# EAGLE design power (EAGLE 8.0.1)
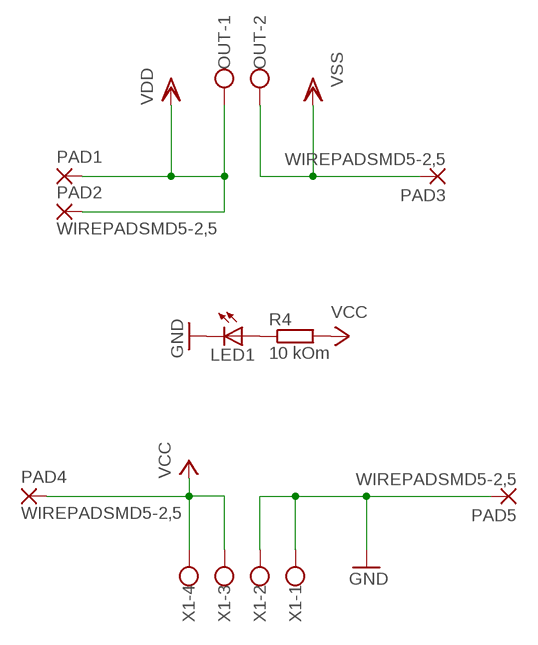
[diagram p0: schematic, sheet 1]

## Parts
LED1  LED3MM  [LED3MM]
OUT  W237-102  [W237-102]
PAD1  2,54/1,0  [2,54/1,0]
PAD2  WIREPADSMD5-2,5  [5-2,5]
PAD3  WIREPADSMD5-2,5  [5-2,5]
PAD4  WIREPADSMD5-2,5  [5-2,5]
PAD5  WIREPADSMD5-2,5  [5-2,5]
R4  10 kOm  R-EU_0207/7  [0207/7]
X1  W237-4  [W237-4]

## Nets
GND: LED1.K(C) PAD5.1(P) X1.1 X1.2
N$1: LED1.A R4.1
VCC: PAD4.1(P) R4.2 X1.3 X1.4
VDD: OUT.1 PAD1.1(P) PAD2.1(P)
VSS: OUT.2 PAD3.1(P)

## Library data of the parts
LED1 = led:LED: LED OSRAM: - CHIPLED LG R971, LG N971, LY N971, LG Q971, LY Q971, LO R971, LY R971 LH N974, LH R974 LS Q976, LO Q976, LY Q976 LO Q996 - Hyper CHIPLED LW Q18S LB Q993, LB Q99A, LB R99A - SideLED LS A670, LO A670, LY A670, LG A670, LP A670 LB A673, LV A673, LT A673, LW A673 LH A674 LY A675 LS A676, LA A676, LO A676, LY A676, LW A676 LS A679, LY A679, LG A679 - Hyper Micro SIDELED® LS Y876, LA Y876, LO Y876, LY Y876 LT Y87S - SmartLED LW L88C, LW L88S LB L89C, LB L89S, LG L890 LS L89K, LO L89K, LY L89K LS L896, LA L896, LO L896, LY L896 - TOPLED LS T670, LO T670, LY T670, LG T670, LP T670 LSG T670, LSP T670, LSY T670, LOP T670, LYG T670 LG T671, LOG T671, LSG T671 LB T673, LV T673, LT T673, LW T673 LH T674 LS T676, LA T676, LO T676, LY T676, LB T676, LH T676, LSB T676, LW T676 LB T67C, LV T67C, LT T67C, LS T67K, LO T67K, LY T67K, LW E67C LS E67B, LA E67B, LO E67B, LY E67B, LB E67C, LV E67C, LT E67C LW T67C LS T679, LY T679, LG T679 LS T770, LO T770, LY T770, LG T770, LP T770 LB T773, LV T773, LT T773, LW T773 LH T774 LS E675, LA E675, LY E675, LS T675 LS T776, LA T776, LO T776, LY T776, LB T776 LHGB T686 LT T68C, LB T68C - Hyper Mini TOPLED® LB M676 - Mini TOPLED Santana® LG M470 LS M47K, LO M47K, LY M47K Source: http://www.osram.convergy.de LUXEON: - LUMILED® LXK2-PW12-R00, LXK2-PW12-S00, LXK2-PW14-U00, LXK2-PW14-V00 LXK2-PM12-R00, LXK2-PM12-S00, LXK2-PM14-U00 LXK2-PE12-Q00, LXK2-PE12-R00, LXK2-PE12-S00, LXK2-PE14-T00, LXK2-PE14-U00 LXK2-PB12-K00, LXK2-PB12-L00, LXK2-PB12-M00, LXK2-PB14-N00, LXK2-PB14-P00, LXK2-PB14-Q00 LXK2-PR12-L00, LXK2-PR12-M00, LXK2-PR14-Q00, LXK2-PR14-R00 LXK2-PD12-Q00, LXK2-PD12-R00, LXK2-PD12-S00 LXK2-PH12-R00, LXK2-PH12-S00 LXK2-PL12-P00, LXK2-PL12-Q00, LXK2-PL12-R00 Source: www.luxeon.com KINGBRIGHT: KA-3528ASYC Source: www.kingbright.com
OUT = con-wago-500:W237-102: WAGO SCREW CLAMP; MPN: 237-102; OC_FARNELL: unknown; OC_NEWARK: 70K9898
PAD1 = wirepad:2,54/1,0: THROUGH-HOLE PAD
PAD2-PAD5 = wirepad:WIREPAD: Wire PAD connect wire on PCB
R4 = resistor:R-EU_: RESISTOR, European symbol
X1 = con-wago-500:W237-4: WAGO SCREW CLAMP; OC_FARNELL: unknown; OC_NEWARK: unknown

## Board
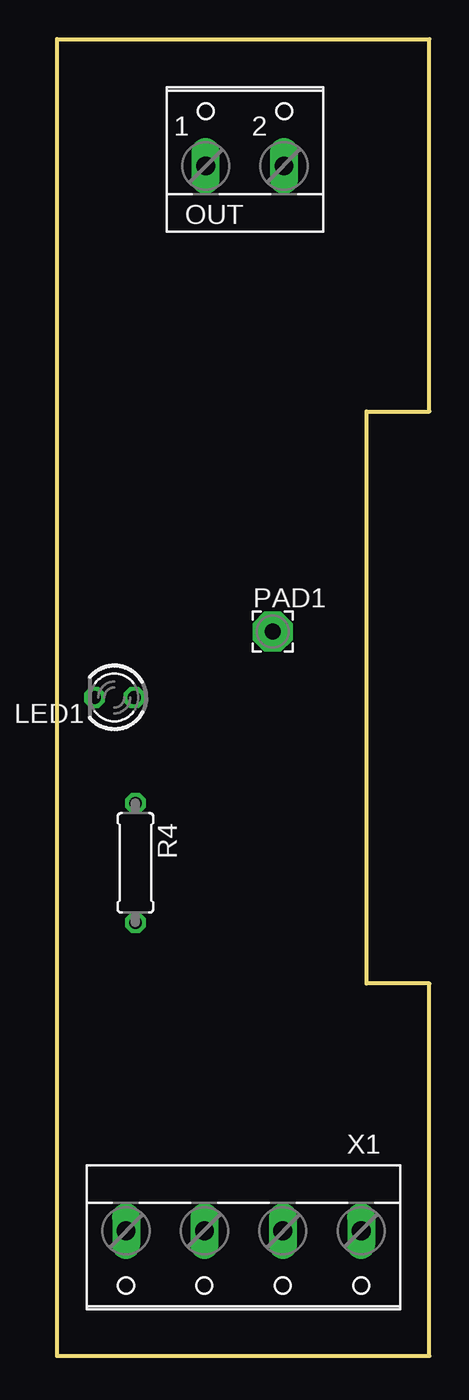
[diagram p1: board, top side]
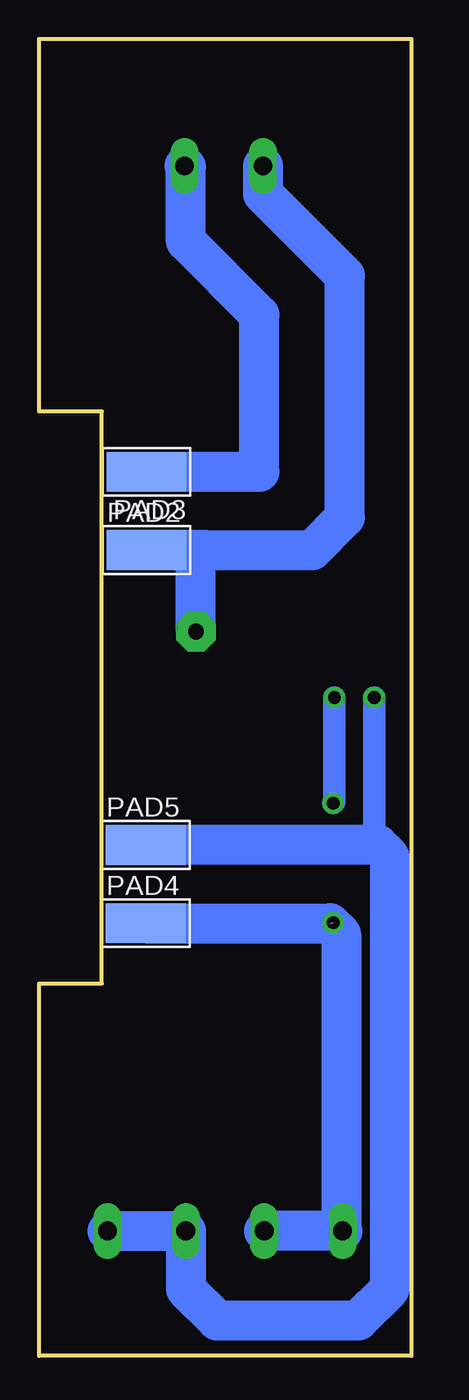
[diagram p2: board, bottom side, seen from below]

Size 23.75 x 84 mm. Coordinates in mm from the lower left corner, seen from the top.
Outline: 0,84 23.75,84 23.75,60.25 19.75,60.25 19.75,23.75 23.75,23.75 23.75,0 0,0 0,84
Copper layers (1*16): Top 0.035mm / dielectric 1.5mm / Bottom 0.035mm
Design rules "default": minimum track width 10mil, minimum drill 24mil, track to track 8mil, track to pad 8mil, pad to pad 8mil, via to via 8mil, smd to smd 8mil, copper to edge 40mil, drill to drill 8mil, minimum pad ring 10mil, minimum via ring 8mil, stop-mask expansion 4mil, vias tented up to drill 0mil, thermal gap 10mil

### Footprints (pad centres in the part's own frame; a part is rotated, then mirrored left to right if it is on the bottom)
LED3MM = drill 0.813 octagon: A -1.27,0; K 1.27,0
W237-102 = drill 1.194 long: 1 -2.5,-1.27; 2 2.5,-1.27
2,54/1,0 = drill 1.016 pad 2.54 octagon: 1 0,0
5-2,5 = smd 2.54 x 5.08: 1 0,0
0207/7 = drill 0.813 octagon: 1 -3.81,0; 2 3.81,0
W237-4 = drill 1.194 long: 1 -7.5,-1.27; 2 -2.5,-1.27; 3 2.5,-1.27; 4 7.5,-1.27

### Placement (x,y rotation side)
LED1  3.65,42 180 top
OUT  11.98,77.19 0 top
PAD1  13.75,46.2 0 top
PAD2  16.9,51.4 270 bottom
PAD3  16.9,56.4 90 bottom
PAD4  16.95,27.6 270 bottom
PAD5  16.95,32.6 270 bottom
R4  5,31.45 270 top
X1  11.9,6.7 180 top

### Tracks (layer width: path | path; a pad name or v marks a point on that pad's centre or on a via)
GND
  Bottom 1.422: LED1.K 2.38,32.83 1.4,31.85
  Bottom 2.54: X1.1 X1.2 14.4,4.25 12.4,2.25 3.4,2.25 1.4,4.25 1.4,31.85 2.15,32.6 PAD5.1
N$1
  Bottom 1.422: LED1.A 4.92,35.34 R4.1
VCC  (1 unrouted)
  Bottom 2.54: X1.3 X1.4 4.5,8.07 4.5,26.9 5.2,27.6 PAD4.1
VDD
  Bottom 2.54: OUT.1 9.48,74.13 4.25,68.9 4.25,53.5 6.35,51.4 13,51.4 | 13,51.4 PAD2.1 | PAD1.1 13.75,50.65 13,51.4
VSS
  Bottom 2.54: PAD3.1 9.7,56.4 9.7,66.4 14.4,71.1 14.4,75.84 OUT.2